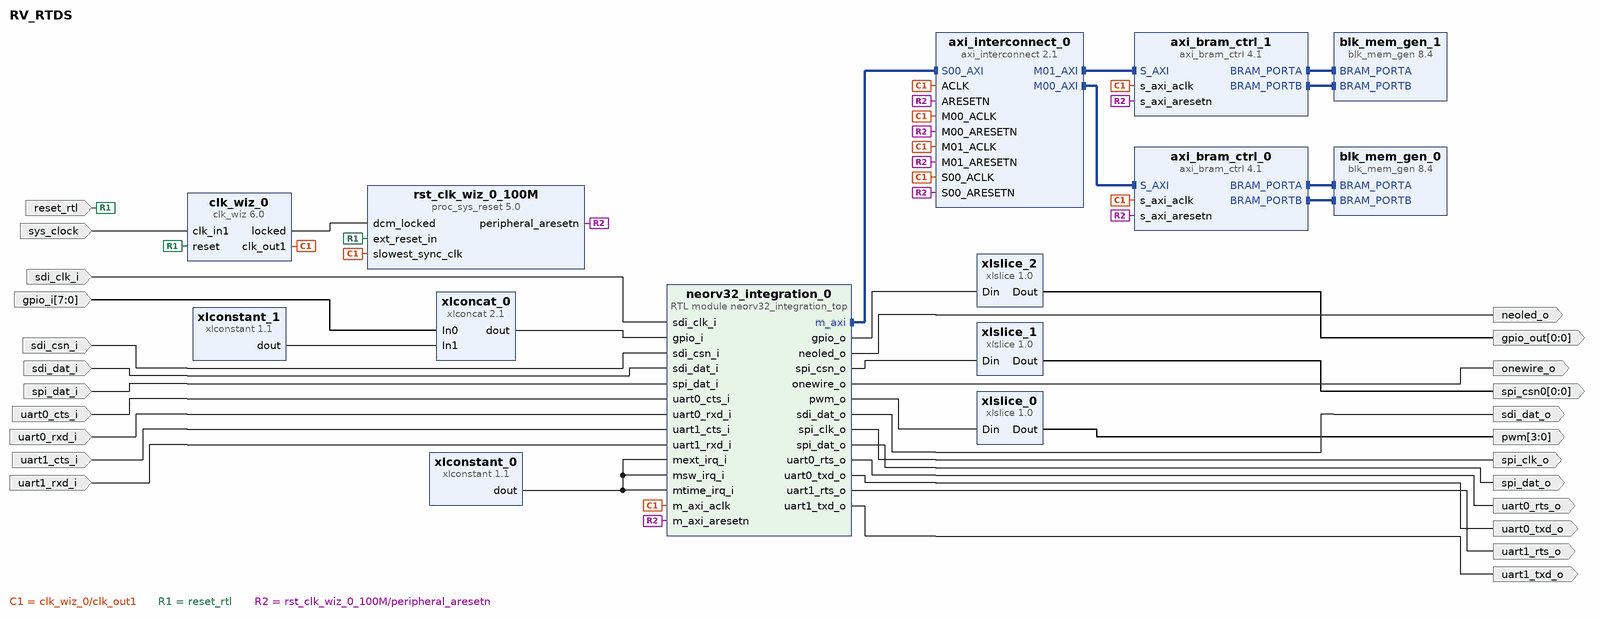
[diagram p0: block diagram of the top level]
# Vivado block design RV_RTDS, xc7z020clg400-1, Vivado 2023.2
create_bd_design RV_RTDS

create_bd_port -dir I -type clk sys_clock
set_property -dict {CONFIG.FREQ_HZ 125000000 CONFIG.PHASE 0.0} [get_bd_ports sys_clock]
create_bd_port -dir I -type rst reset_rtl
set_property -dict {CONFIG.POLARITY ACTIVE_HIGH} [get_bd_ports reset_rtl]
create_bd_port -dir I -from 7 -to 0 gpio_i
create_bd_port -dir I uart0_rxd_i
create_bd_port -dir I uart0_cts_i
create_bd_port -dir I uart1_rxd_i
create_bd_port -dir I uart1_cts_i
create_bd_port -dir I spi_dat_i
create_bd_port -dir I sdi_clk_i
create_bd_port -dir I sdi_csn_i
create_bd_port -dir I sdi_dat_i
create_bd_port -dir O -from 0 -to 0 -type data gpio_out
create_bd_port -dir O -from 0 -to 0 spi_csn0
create_bd_port -dir O -from 3 -to 0 pwm
create_bd_port -dir O uart0_txd_o
create_bd_port -dir O uart0_rts_o
create_bd_port -dir O neoled_o
create_bd_port -dir O onewire_o
create_bd_port -dir O sdi_dat_o
create_bd_port -dir O spi_dat_o
create_bd_port -dir O uart1_rts_o
create_bd_port -dir O spi_clk_o
create_bd_port -dir O uart1_txd_o

create_bd_cell -type ip -vlnv xilinx.com:ip:axi_interconnect:2.1 axi_interconnect_0
create_bd_cell -type ip -vlnv xilinx.com:ip:axi_bram_ctrl:4.1 axi_bram_ctrl_0
create_bd_cell -type ip -vlnv xilinx.com:ip:axi_bram_ctrl:4.1 axi_bram_ctrl_1
create_bd_cell -type ip -vlnv xilinx.com:ip:blk_mem_gen:8.4 blk_mem_gen_0
set_property -dict {CONFIG.Memory_Type True_Dual_Port_RAM} [get_bd_cells blk_mem_gen_0]
create_bd_cell -type ip -vlnv xilinx.com:ip:blk_mem_gen:8.4 blk_mem_gen_1
set_property -dict {CONFIG.Memory_Type True_Dual_Port_RAM} [get_bd_cells blk_mem_gen_1]
create_bd_cell -type ip -vlnv xilinx.com:ip:xlslice:1.0 xlslice_0
set_property -dict {CONFIG.DIN_FROM 3 CONFIG.DIN_WIDTH 4 CONFIG.DOUT_WIDTH 3} [get_bd_cells xlslice_0]
create_bd_cell -type ip -vlnv xilinx.com:ip:xlslice:1.0 xlslice_1
set_property -dict {CONFIG.DIN_WIDTH 8} [get_bd_cells xlslice_1]
create_bd_cell -type ip -vlnv xilinx.com:ip:xlslice:1.0 xlslice_2
set_property -dict {CONFIG.DIN_FROM 0 CONFIG.DOUT_WIDTH 4} [get_bd_cells xlslice_2]
create_bd_cell -type ip -vlnv xilinx.com:ip:xlconstant:1.1 xlconstant_0
create_bd_cell -type ip -vlnv xilinx.com:ip:xlconcat:2.1 xlconcat_0
create_bd_cell -type ip -vlnv xilinx.com:ip:clk_wiz:6.0 clk_wiz_0
set_property -dict {CONFIG.CLK_IN1_BOARD_INTERFACE sys_clock CONFIG.USE_BOARD_FLOW true} [get_bd_cells clk_wiz_0]
create_bd_cell -type ip -vlnv xilinx.com:ip:xlconstant:1.1 xlconstant_1
create_bd_cell -type ip -vlnv xilinx.com:ip:proc_sys_reset:5.0 rst_clk_wiz_0_100M
create_bd_cell -type module -reference neorv32_integration_top neorv32_integration_0
set_property -dict {CONFIG.PMP_NUM_REGIONS 0 CONFIG.VENDOR_ID 0 CONFIG.XIRQ_NUM_CH 0} [get_bd_cells neorv32_integration_0]

# ---- connections ----

connect_bd_intf_net [get_bd_intf_pins blk_mem_gen_0/BRAM_PORTA] [get_bd_intf_pins axi_bram_ctrl_0/BRAM_PORTA]
connect_bd_intf_net [get_bd_intf_pins blk_mem_gen_0/BRAM_PORTB] [get_bd_intf_pins axi_bram_ctrl_0/BRAM_PORTB]
connect_bd_intf_net [get_bd_intf_pins blk_mem_gen_1/BRAM_PORTA] [get_bd_intf_pins axi_bram_ctrl_1/BRAM_PORTA]
connect_bd_intf_net [get_bd_intf_pins blk_mem_gen_1/BRAM_PORTB] [get_bd_intf_pins axi_bram_ctrl_1/BRAM_PORTB]
connect_bd_intf_net [get_bd_intf_pins axi_interconnect_0/M00_AXI] [get_bd_intf_pins axi_bram_ctrl_0/S_AXI]
connect_bd_intf_net [get_bd_intf_pins axi_interconnect_0/M01_AXI] [get_bd_intf_pins axi_bram_ctrl_1/S_AXI]
connect_bd_intf_net [get_bd_intf_pins neorv32_integration_0/m_axi] [get_bd_intf_pins axi_interconnect_0/S00_AXI]
connect_bd_net [get_bd_pins clk_wiz_0/clk_out1] \
  [get_bd_pins axi_interconnect_0/S00_ACLK] [get_bd_pins rst_clk_wiz_0_100M/slowest_sync_clk] \
  [get_bd_pins axi_bram_ctrl_0/s_axi_aclk] [get_bd_pins axi_interconnect_0/M00_ACLK] [get_bd_pins axi_interconnect_0/ACLK] \
  [get_bd_pins axi_bram_ctrl_1/s_axi_aclk] [get_bd_pins axi_interconnect_0/M01_ACLK] \
  [get_bd_pins neorv32_integration_0/m_axi_aclk]
connect_bd_net [get_bd_pins clk_wiz_0/locked] [get_bd_pins rst_clk_wiz_0_100M/dcm_locked]
connect_bd_net [get_bd_ports gpio_i] [get_bd_pins xlconcat_0/In0]
connect_bd_net [get_bd_pins neorv32_integration_0/gpio_o] [get_bd_pins xlslice_2/Din]
connect_bd_net [get_bd_pins neorv32_integration_0/neoled_o] [get_bd_ports neoled_o]
connect_bd_net [get_bd_pins neorv32_integration_0/onewire_o] [get_bd_ports onewire_o]
connect_bd_net [get_bd_pins neorv32_integration_0/pwm_o] [get_bd_pins xlslice_0/Din]
connect_bd_net [get_bd_pins neorv32_integration_0/sdi_dat_o] [get_bd_ports sdi_dat_o]
connect_bd_net [get_bd_pins neorv32_integration_0/spi_clk_o] [get_bd_ports spi_clk_o]
connect_bd_net [get_bd_pins neorv32_integration_0/spi_csn_o] [get_bd_pins xlslice_1/Din]
connect_bd_net [get_bd_pins neorv32_integration_0/spi_dat_o] [get_bd_ports spi_dat_o]
connect_bd_net [get_bd_pins neorv32_integration_0/uart0_rts_o] [get_bd_ports uart0_rts_o]
connect_bd_net [get_bd_pins neorv32_integration_0/uart0_txd_o] [get_bd_ports uart0_txd_o]
connect_bd_net [get_bd_pins neorv32_integration_0/uart1_rts_o] [get_bd_ports uart1_rts_o]
connect_bd_net [get_bd_pins neorv32_integration_0/uart1_txd_o] [get_bd_ports uart1_txd_o]
connect_bd_net [get_bd_ports reset_rtl] [get_bd_pins clk_wiz_0/reset] [get_bd_pins rst_clk_wiz_0_100M/ext_reset_in]
connect_bd_net [get_bd_pins rst_clk_wiz_0_100M/peripheral_aresetn] \
  [get_bd_pins axi_interconnect_0/S00_ARESETN] [get_bd_pins axi_bram_ctrl_0/s_axi_aresetn] \
  [get_bd_pins axi_interconnect_0/M00_ARESETN] [get_bd_pins axi_interconnect_0/ARESETN] \
  [get_bd_pins axi_bram_ctrl_1/s_axi_aresetn] [get_bd_pins axi_interconnect_0/M01_ARESETN] \
  [get_bd_pins neorv32_integration_0/m_axi_aresetn]
connect_bd_net [get_bd_ports sdi_clk_i] [get_bd_pins neorv32_integration_0/sdi_clk_i]
connect_bd_net [get_bd_ports sdi_csn_i] [get_bd_pins neorv32_integration_0/sdi_csn_i]
connect_bd_net [get_bd_ports sdi_dat_i] [get_bd_pins neorv32_integration_0/sdi_dat_i]
connect_bd_net [get_bd_ports spi_dat_i] [get_bd_pins neorv32_integration_0/spi_dat_i]
connect_bd_net [get_bd_ports sys_clock] [get_bd_pins clk_wiz_0/clk_in1]
connect_bd_net [get_bd_ports uart0_cts_i] [get_bd_pins neorv32_integration_0/uart0_cts_i]
connect_bd_net [get_bd_ports uart0_rxd_i] [get_bd_pins neorv32_integration_0/uart0_rxd_i]
connect_bd_net [get_bd_ports uart1_cts_i] [get_bd_pins neorv32_integration_0/uart1_cts_i]
connect_bd_net [get_bd_ports uart1_rxd_i] [get_bd_pins neorv32_integration_0/uart1_rxd_i]
connect_bd_net [get_bd_pins xlconcat_0/dout] [get_bd_pins neorv32_integration_0/gpio_i]
connect_bd_net [get_bd_pins xlconstant_0/dout] \
  [get_bd_pins neorv32_integration_0/mtime_irq_i] [get_bd_pins neorv32_integration_0/msw_irq_i] \
  [get_bd_pins neorv32_integration_0/mext_irq_i]
connect_bd_net [get_bd_pins xlconstant_1/dout] [get_bd_pins xlconcat_0/In1]
connect_bd_net [get_bd_pins xlslice_0/Dout] [get_bd_ports pwm]
connect_bd_net [get_bd_pins xlslice_1/Dout] [get_bd_ports spi_csn0]
connect_bd_net [get_bd_pins xlslice_2/Dout] [get_bd_ports gpio_out]

# ---- address map ----
assign_bd_address -offset 0xC0000000 -range 8K -target_address_space [get_bd_addr_spaces neorv32_integration_0/m_axi] [get_bd_addr_segs axi_bram_ctrl_0/S_AXI/Mem0]
assign_bd_address -offset 0xC2000000 -range 8K -target_address_space [get_bd_addr_spaces neorv32_integration_0/m_axi] [get_bd_addr_segs axi_bram_ctrl_1/S_AXI/Mem0]

validate_bd_design
save_bd_design
